# Altium schematic sheet MIPI.SchDoc: MIPI
size 420 x 297 mm; SheetNumber: 10
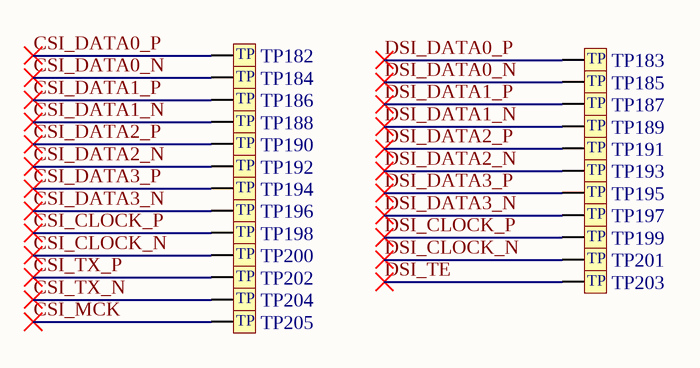
[diagram p0: MIPI.SchDoc]

## Parts
TP182  TP_0P8MM  [TP_0P8MM]  (value not drawn)  (no BOM)
TP183  TP_0P8MM  [TP_0P8MM]  (value not drawn)  (no BOM)
TP184  TP_0P8MM  [TP_0P8MM]  (value not drawn)  (no BOM)
TP185  TP_0P8MM  [TP_0P8MM]  (value not drawn)  (no BOM)
TP186  TP_0P8MM  [TP_0P8MM]  (value not drawn)  (no BOM)
TP187  TP_0P8MM  [TP_0P8MM]  (value not drawn)  (no BOM)
TP188  TP_0P8MM  [TP_0P8MM]  (value not drawn)  (no BOM)
TP189  TP_0P8MM  [TP_0P8MM]  (value not drawn)  (no BOM)
TP190  TP_0P8MM  [TP_0P8MM]  (value not drawn)  (no BOM)
TP191  TP_0P8MM  [TP_0P8MM]  (value not drawn)  (no BOM)
TP192  TP_0P8MM  [TP_0P8MM]  (value not drawn)  (no BOM)
TP193  TP_0P8MM  [TP_0P8MM]  (value not drawn)  (no BOM)
TP194  TP_0P8MM  [TP_0P8MM]  (value not drawn)  (no BOM)
TP195  TP_0P8MM  [TP_0P8MM]  (value not drawn)  (no BOM)
TP196  TP_0P8MM  [TP_0P8MM]  (value not drawn)  (no BOM)
TP197  TP_0P8MM  [TP_0P8MM]  (value not drawn)  (no BOM)
TP198  TP_0P8MM  [TP_0P8MM]  (value not drawn)  (no BOM)
TP199  TP_0P8MM  [TP_0P8MM]  (value not drawn)  (no BOM)
TP200  TP_0P8MM  [TP_0P8MM]  (value not drawn)  (no BOM)
TP201  TP_0P8MM  [TP_0P8MM]  (value not drawn)  (no BOM)
TP202  TP_0P8MM  [TP_0P8MM]  (value not drawn)  (no BOM)
TP203  TP_0P8MM  [TP_0P8MM]  (value not drawn)  (no BOM)
TP204  TP_0P8MM  [TP_0P8MM]  (value not drawn)  (no BOM)
TP205  TP_0P8MM  [TP_0P8MM]  (value not drawn)  (no BOM)

## Nets
CSI_CLOCK_N: TP200.1
CSI_CLOCK_P: TP198.1
CSI_DATA0_N: TP184.1
CSI_DATA0_P: TP182.1
CSI_DATA1_N: TP188.1
CSI_DATA1_P: TP186.1
CSI_DATA2_N: TP192.1
CSI_DATA2_P: TP190.1
CSI_DATA3_N: TP196.1
CSI_DATA3_P: TP194.1
CSI_MCK: TP205.1
CSI_TX_N: TP204.1
CSI_TX_P: TP202.1
DSI_CLOCK_N: TP201.1
DSI_CLOCK_P: TP199.1
DSI_DATA0_N: TP185.1
DSI_DATA0_P: TP183.1
DSI_DATA1_N: TP189.1
DSI_DATA1_P: TP187.1
DSI_DATA2_N: TP193.1
DSI_DATA2_P: TP191.1
DSI_DATA3_N: TP197.1
DSI_DATA3_P: TP195.1
DSI_TE: TP203.1

## Notes on the sheet
- PROJECT
- SIZE
- FILE NAME
- A3
- TITLE
- SHEET
- OF
- REV
- (in symbol TP_0P8MM) TP

## Library data of the parts
TP182-TP205 = TP_0P8MM: OSM Footprint 0P8 LGA Ball